# EAGLE design untitled (EAGLE 6.4)
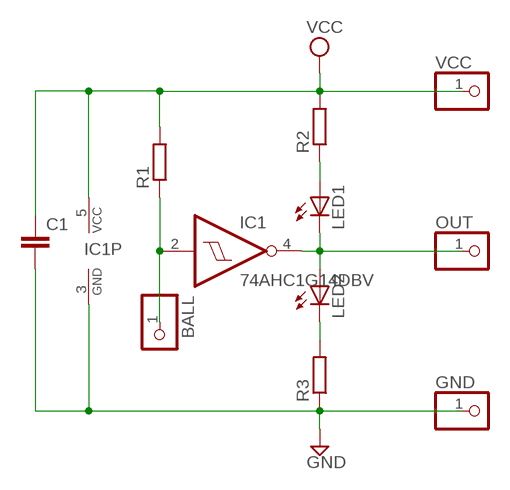
[diagram p0: schematic, sheet 1]

## Parts
BALL  PINHD-1X1  [1X01]
C1  C-EUC0805  [C0805]
GND  PINHD-1X1  [1X01]
IC1  74AHC1G14DBV  [SOT23-5]
LED1  LEDCHIP-LED0805  [CHIP-LED0805]
LED2  LEDCHIP-LED0805  [CHIP-LED0805]
OUT  PINHD-1X1  [1X01]
R1  R-EU_R0805  [R0805]
R2  R-EU_R0805  [R0805]
R3  R-EU_R0805  [R0805]
VCC  PINHD-1X1  [1X01]

## Nets
BALL: BALL.1 IC1.2(I) R1.1
GND: C1.2 GND.1 IC1.3(GND) R3.1
N$3: LED1.A R2.1
N$4: LED2.C R3.2
OUT: IC1.4(O) LED1.C LED2.A OUT.1
VCC: C1.1 IC1.5(VCC) R1.2 R2.2 VCC.1

## Library data of the parts
BALL GND OUT VCC = pinhead:PINHD-1X1: PIN HEADER
C1 = rcl:C-EU: CAPACITOR, European symbol
IC1 = 74xx-little-us:74*1G14: Single Schmitt-Trigger Inverter Gate
LED1 LED2 = led:LED: LED OSRAM: - CHIPLED LG R971, LG N971, LY N971, LG Q971, LY Q971, LO R971, LY R971 LH N974, LH R974 LS Q976, LO Q976, LY Q976 LO Q996 - Hyper CHIPLED LW Q18S LB Q993, LB Q99A, LB R99A - SideLED LS A670, LO A670, LY A670, LG A670, LP A670 LB A673, LV A673, LT A673, LW A673 LH A674 LY A675 LS A676, LA A676, LO A676, LY A676, LW A676 LS A679, LY A679, LG A679 - Hyper Micro SIDELED® LS Y876, LA Y876, LO Y876, LY Y876 LT Y87S - SmartLED LW L88C, LW L88S LB L89C, LB L89S, LG L890 LS L89K, LO L89K, LY L89K LS L896, LA L896, LO L896, LY L896 - TOPLED LS T670, LO T670, LY T670, LG T670, LP T670 LSG T670, LSP T670, LSY T670, LOP T670, LYG T670 LG T671, LOG T671, LSG T671 LB T673, LV T673, LT T673, LW T673 LH T674 LS T676, LA T676, LO T676, LY T676, LB T676, LH T676, LSB T676, LW T676 LB T67C, LV T67C, LT T67C, LS T67K, LO T67K, LY T67K, LW E67C LS E67B, LA E67B, LO E67B, LY E67B, LB E67C, LV E67C, LT E67C LW T67C LS T679, LY T679, LG T679 LS T770, LO T770, LY T770, LG T770, LP T770 LB T773, LV T773, LT T773, LW T773 LH T774 LS E675, LA E675, LY E675, LS T675 LS T776, LA T776, LO T776, LY T776, LB T776 LHGB T686 LT T68C, LB T68C - Hyper Mini TOPLED® LB M676 - Mini TOPLED Santana® LG M470 LS M47K, LO M47K, LY M47K Source: http://www.osram.convergy.de LUXEON: - LUMILED® LXK2-PW12-R00, LXK2-PW12-S00, LXK2-PW14-U00, LXK2-PW14-V00 LXK2-PM12-R00, LXK2-PM12-S00, LXK2-PM14-U00 LXK2-PE12-Q00, LXK2-PE12-R00, LXK2-PE12-S00, LXK2-PE14-T00, LXK2-PE14-U00 LXK2-PB12-K00, LXK2-PB12-L00, LXK2-PB12-M00, LXK2-PB14-N00, LXK2-PB14-P00, LXK2-PB14-Q00 LXK2-PR12-L00, LXK2-PR12-M00, LXK2-PR14-Q00, LXK2-PR14-R00 LXK2-PD12-Q00, LXK2-PD12-R00, LXK2-PD12-S00 LXK2-PH12-R00, LXK2-PH12-S00 LXK2-PL12-P00, LXK2-PL12-Q00, LXK2-PL12-R00 Source: www.luxeon.com KINGBRIGHT: KA-3528ASYC Source: www.kingbright.com
R1-R3 = rcl:R-EU_: RESISTOR, European symbol

## Net classes
0 default: width 0.5 mm, drill 0.5 mm, clearance 0.355 mm

## Board
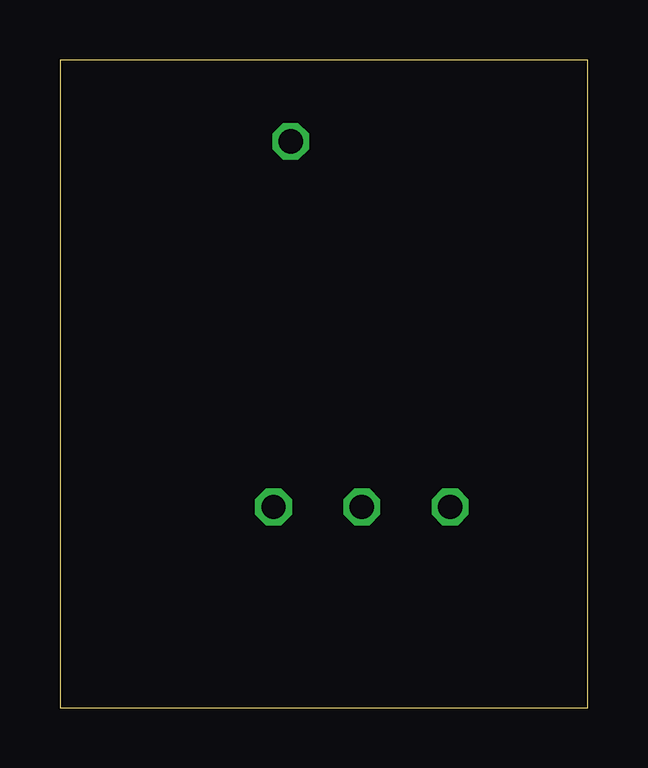
[diagram p1: board, top side]
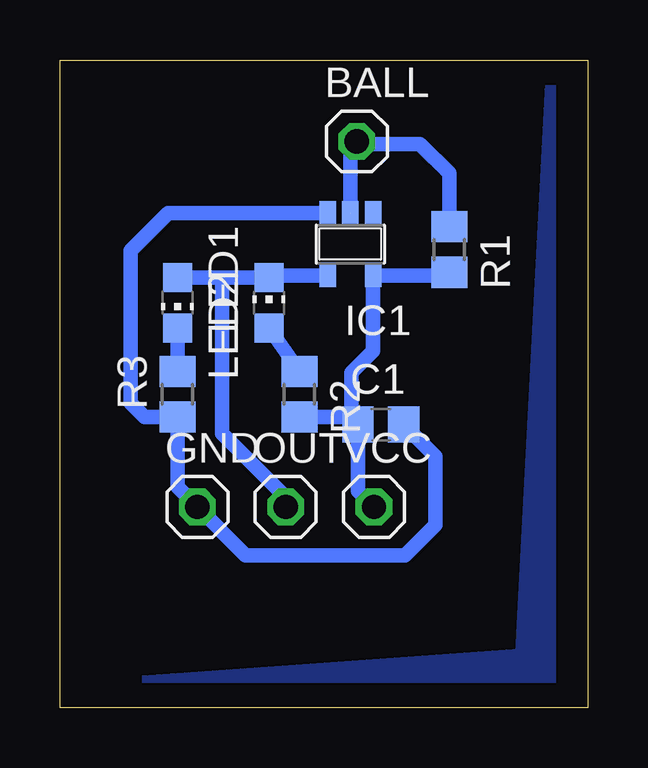
[diagram p2: board, bottom side, seen from below]

Size 22 x 27 mm. Coordinates in mm from the lower left corner, seen from the top.
Outline: 0,0 22,0 22,27 0,27 0,0
Copper layers (1*16): Top 0.035mm / dielectric 1.5mm / Bottom 0.035mm
Design rules "default": minimum track width 10mil, minimum drill 24mil, track to track 8mil, track to pad 8mil, pad to pad 8mil, via to via 8mil, smd to smd 8mil, copper to edge 40mil, drill to drill 8mil, minimum pad ring 10mil, minimum via ring 8mil, stop-mask expansion 4mil, vias tented up to drill 0mil, thermal gap 10mil

### Footprints (pad centres in the part's own frame; a part is rotated, then mirrored left to right if it is on the bottom)
1X01 = drill 1.016 octagon: 1 0,0
C0805 = smd 1.3 x 1.5: 1 -0.95,0; 2 0.95,0
SOT23-5 = smd 0.69 x 0.99: 1 -0.95,-1.29; 2 0,-1.29; 3 0.95,-1.29; 4 0.95,1.3; 5 -0.95,1.3
CHIP-LED0805 = smd 1.2 x 1.2: A 0,-1.05; C 0,1.05
R0805 = smd 1.3 x 1.5: 1 -0.95,0; 2 0.95,0

### Placement (x,y rotation side)
BALL  9.62,23.61 0 bottom
C1  8.62,11.79 0 bottom
GND  16.27,8.37 0 bottom
IC1  9.89,19.32 180 bottom
LED1  13.29,16.88 0 bottom
LED2  17.1,16.88 180 bottom
OUT  12.59,8.37 0 bottom
R1  5.76,19.1 270 bottom
R2  12.02,13.06 270 bottom
R3  17.1,13.06 90 bottom
VCC  8.9,8.37 0 bottom

### Tracks (layer width: path | path; a pad name or v marks a point on that pad's centre or on a via)
BALL
  Bottom 0.61: R1.1 5.76,22.27 6.99,23.5 9.51,23.5 BALL.1 9.89,23.33 IC1.2
GND
  Bottom 0.61: C1.2 6.35,10.47 6.35,7.62 7.62,6.35 11.43,6.35 14.26,6.35 GND.1 17.1,9.19 R3.1 18.46,12.12 19.05,12.7 19.05,19.05 17.49,20.61 IC1.3
  pour Bottom: 1.54,1 20.59,1 2.81,2.27 1.54,26.4
N$3
  Bottom 0.61: R2.1 LED1.A
N$4
  Bottom 0.61: R3.2 LED2.C
OUT
  Bottom 0.61: IC1.4 13.19,18.02 LED1.C 15.24,17.93 | 15.24,17.93 LED2.A | OUT.1 12.59,8.78 15.24,11.43 15.24,17.93
VCC
  Bottom 0.61: R1.2 5.89,18.02 IC1.5 8.94,14.87 9.84,13.97 9.84,12.07 C1.1 | R2.2 9.89,12.12 C1.1 | C1.1 9.57,9.03 VCC.1